# EAGLE design ac (EAGLE 7.4.0)
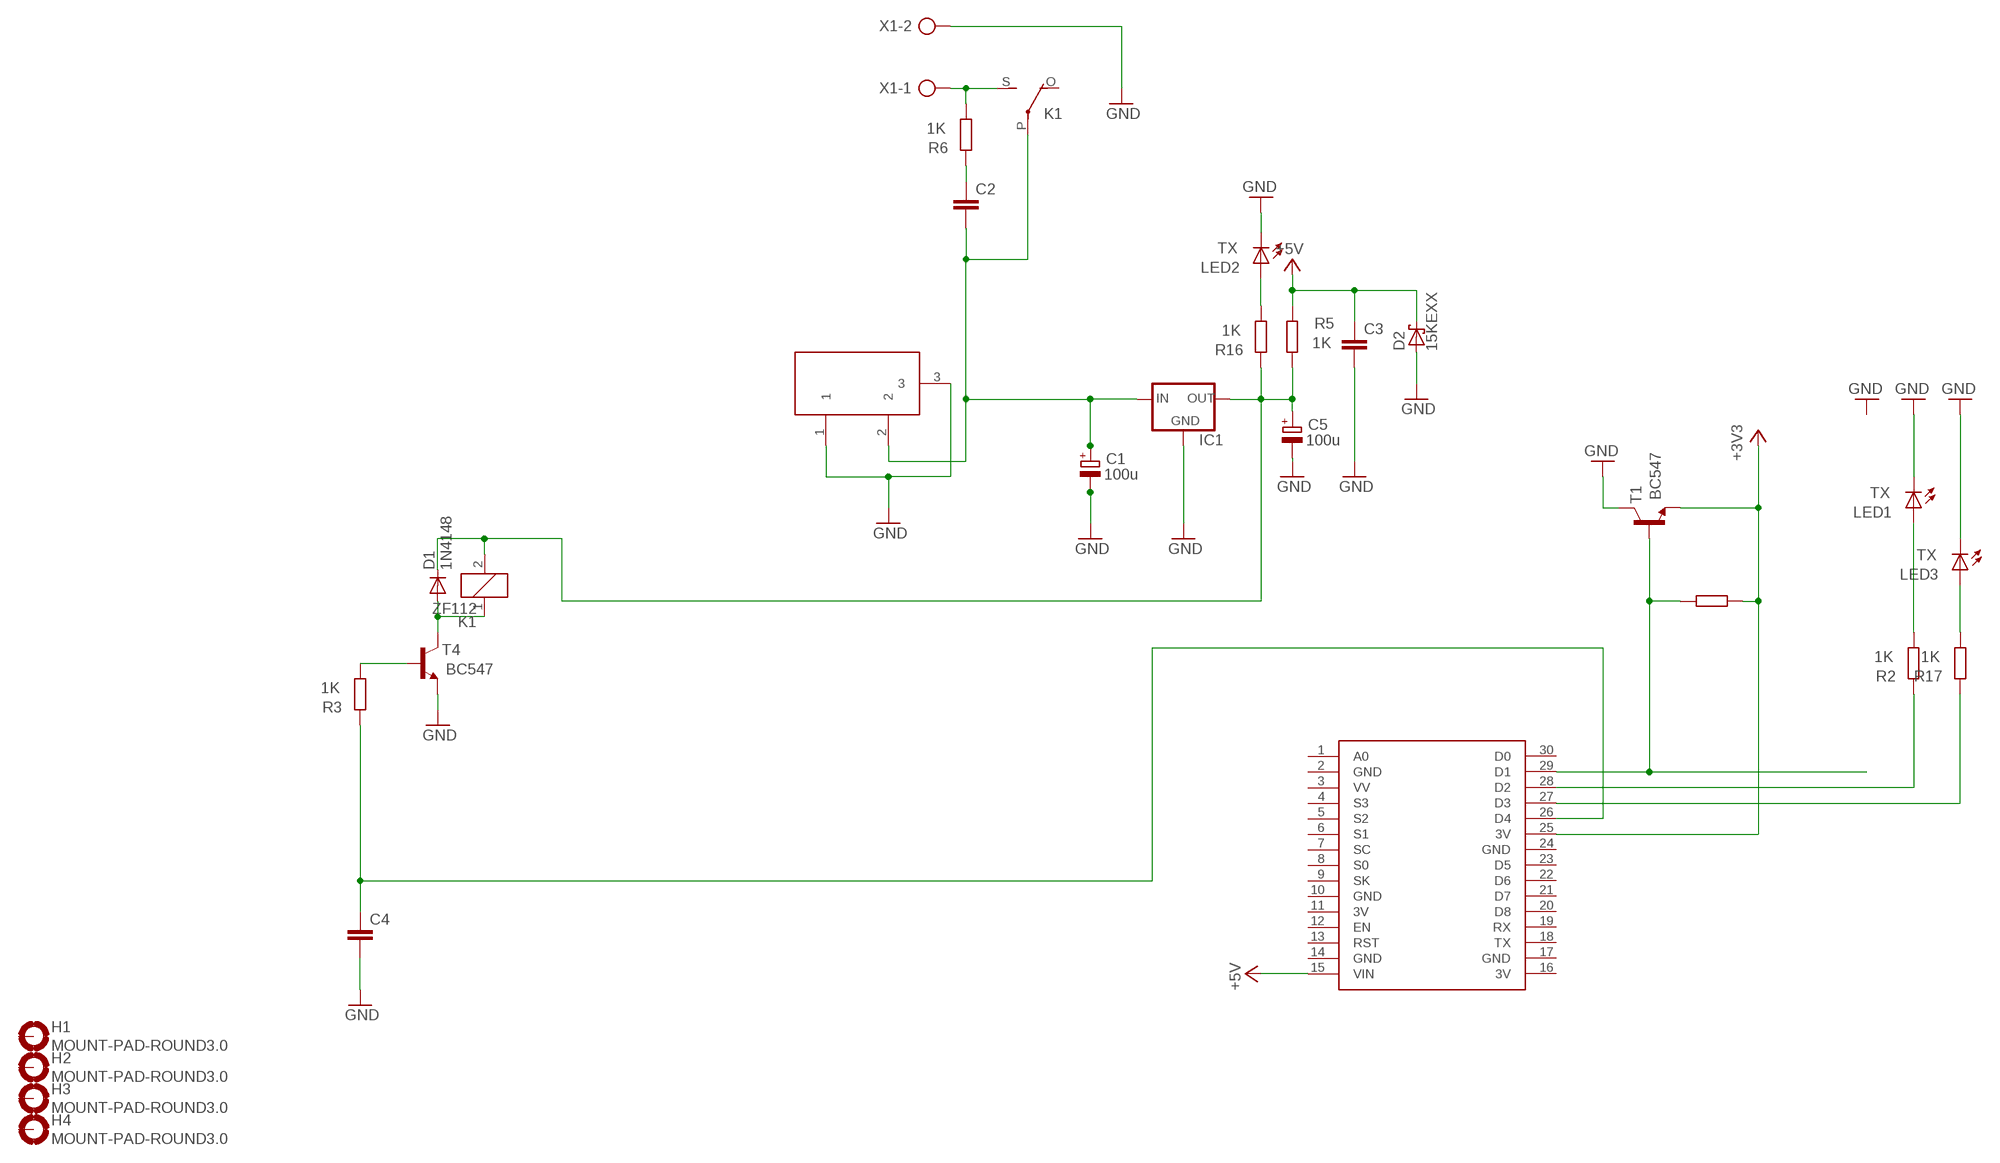
[diagram p0: schematic, sheet 1]

## Parts
C1  100u  CPOL-EUE3.5-8  [E3,5-8]
C2  C-EU102-043X133  [C102-043X133]
C3  C-EU102-043X133  [C102-043X133]
C4  C-EU102-043X133  [C102-043X133]
C5  100u  CPOL-EUE3.5-8  [E3,5-8]
D1  1N4148  [DO35-10]
D2  15KEXX  [CB429-17]
DC1  DC21MMX  [DC-21MM]
H1  MOUNT-PAD-ROUND3.0  [3,0-PAD]
H2  MOUNT-PAD-ROUND3.0  [3,0-PAD]
H3  MOUNT-PAD-ROUND3.0  [3,0-PAD]
H4  MOUNT-PAD-ROUND3.0  [3,0-PAD]
IC1  78XXS  [78XXS]
K1  ZF112  [ZF112]
LED1  TX  LED5MM  [LED5MM]
LED2  TX  LED5MM  [LED5MM]
LED3  TX  LED5MM  [LED5MM]
R2  1K  R-EU_0207/10  [0207/10]
R3  1K  R-EU_0207/10  [0207/10]
R4  1k  R-EU_0207/10  [0207/10]
R5  1K  R-EU_0207/10  [0207/10]
R6  1K  R-EU_0207/10  [0207/10]
R16  1K  R-EU_0207/10  [0207/10]
R17  1K  R-EU_0207/10  [0207/10]
T1  BC547  [TO92]
T4  BC547  [TO92]
U$1  NODEMCU  [NODEMCU]
X1  AK300/2  [AK300/2]

## Nets
+3V3: R4.1 T1.1(E) U$1.25(3V)
+5V [power]: C3.1 D2.C R5.2 U$1.15(VIN)
GND: C1.- C3.2 C4.2 C5.- D2.A DC1.1 DC1.3 IC1.GND LED1.K(C) LED2.K(C) LED3.K(C) T1.3(C) T4.1(E) X1.2
N$1: R3.1 T4.2(B)
N$2: K1.S(2:S) R6.1 X1.1
N$4: D1.A K1.1 T4.3(C)
N$5: C2.1 R6.2
N$6: C1.+ C2.2 DC1.2 IC1.IN K1.P(2:P)
N$7 [power]: C5.+ D1.C IC1.OUT K1.2 R5.1 R16.2
N$11: R4.2 T1.2(B) U$1.29(D1)
N$12: R2.2 U$1.28(D2)
N$13: R17.2 U$1.27(D3)
N$14: C4.1 R3.2 U$1.26(D4)
N$19: LED2.A R16.1
N$21: LED3.A R17.1
N$32: LED1.A R2.1
Unconnected: H1.B3,0(MOUNT) H2.B3,0(MOUNT) H3.B3,0(MOUNT) H4.B3,0(MOUNT) K1.O(2:O) U$1.1(A0) U$1.3(VV) U$1.4(S3) U$1.5(S2) U$1.6(S1) U$1.7(SC) U$1.8(S0) U$1.9(SK) U$1.12(EN) U$1.13(RST) U$1.18(TX) U$1.19(RX) U$1.20(D8) U$1.21(D7) U$1.22(D6) U$1.23(D5) U$1.30(D0)

## Power pins joined to a net without a drawn wire
3V: U$1.11(3V) U$1.16(3V)
GND: U$1.2(GND) U$1.10(GND) U$1.14(GND) U$1.17(GND) U$1.24(GND)

## Library data of the parts
C1 C5 = rcl:CPOL-EU: POLARIZED CAPACITOR, European symbol
C2-C4 = rcl:C-EU: CAPACITOR, European symbol
D1 = diode:1N4148: DIODE high speed (Philips)
D2 = diode:15KEXX: DIODE
DC1 = powersupply:DC21MM
H1-H4 = holes:MOUNT-PAD-ROUND: MOUNTING PAD, round
IC1 = v-reg:78XXS: VOLTAGE REGULATOR
K1 = relay:ZF112: RELAY 1 x switch; OC_FARNELL: unknown; OC_NEWARK: unknown
LED1-LED3 = led:LED: LED OSRAM: - CHIPLED LG R971, LG N971, LY N971, LG Q971, LY Q971, LO R971, LY R971 LH N974, LH R974 LS Q976, LO Q976, LY Q976 LO Q996 - Hyper CHIPLED LW Q18S LB Q993, LB Q99A, LB R99A - SideLED LS A670, LO A670, LY A670, LG A670, LP A670 LB A673, LV A673, LT A673, LW A673 LH A674 LY A675 LS A676, LA A676, LO A676, LY A676, LW A676 LS A679, LY A679, LG A679 - Hyper Micro SIDELED® LS Y876, LA Y876, LO Y876, LY Y876 LT Y87S - SmartLED LW L88C, LW L88S LB L89C, LB L89S, LG L890 LS L89K, LO L89K, LY L89K LS L896, LA L896, LO L896, LY L896 - TOPLED LS T670, LO T670, LY T670, LG T670, LP T670 LSG T670, LSP T670, LSY T670, LOP T670, LYG T670 LG T671, LOG T671, LSG T671 LB T673, LV T673, LT T673, LW T673 LH T674 LS T676, LA T676, LO T676, LY T676, LB T676, LH T676, LSB T676, LW T676 LB T67C, LV T67C, LT T67C, LS T67K, LO T67K, LY T67K, LW E67C LS E67B, LA E67B, LO E67B, LY E67B, LB E67C, LV E67C, LT E67C LW T67C LS T679, LY T679, LG T679 LS T770, LO T770, LY T770, LG T770, LP T770 LB T773, LV T773, LT T773, LW T773 LH T774 LS E675, LA E675, LY E675, LS T675 LS T776, LA T776, LO T776, LY T776, LB T776 LHGB T686 LT T68C, LB T68C - Hyper Mini TOPLED® LB M676 - Mini TOPLED Santana® LG M470 LS M47K, LO M47K, LY M47K Source: http://www.osram.convergy.de LUXEON: - LUMILED® LXK2-PW12-R00, LXK2-PW12-S00, LXK2-PW14-U00, LXK2-PW14-V00 LXK2-PM12-R00, LXK2-PM12-S00, LXK2-PM14-U00 LXK2-PE12-Q00, LXK2-PE12-R00, LXK2-PE12-S00, LXK2-PE14-T00, LXK2-PE14-U00 LXK2-PB12-K00, LXK2-PB12-L00, LXK2-PB12-M00, LXK2-PB14-N00, LXK2-PB14-P00, LXK2-PB14-Q00 LXK2-PR12-L00, LXK2-PR12-M00, LXK2-PR14-Q00, LXK2-PR14-R00 LXK2-PD12-Q00, LXK2-PD12-R00, LXK2-PD12-S00 LXK2-PH12-R00, LXK2-PH12-S00 LXK2-PL12-P00, LXK2-PL12-Q00, LXK2-PL12-R00 Source: www.luxeon.com KINGBRIGHT: KA-3528ASYC Source: www.kingbright.com
R2-R6 R16 R17 = rcl:R-EU_: RESISTOR, European symbol
T1 T4 = transistor:BC547: NPN TRANSISTOR
U$1 = nodemcu:NODEMCU
X1 = con-ptr500:AK300/2: CONNECTOR; OC_FARNELL: unknown; OC_NEWARK: unknown

## Net classes
1 power: width 0.61 mm

## Board
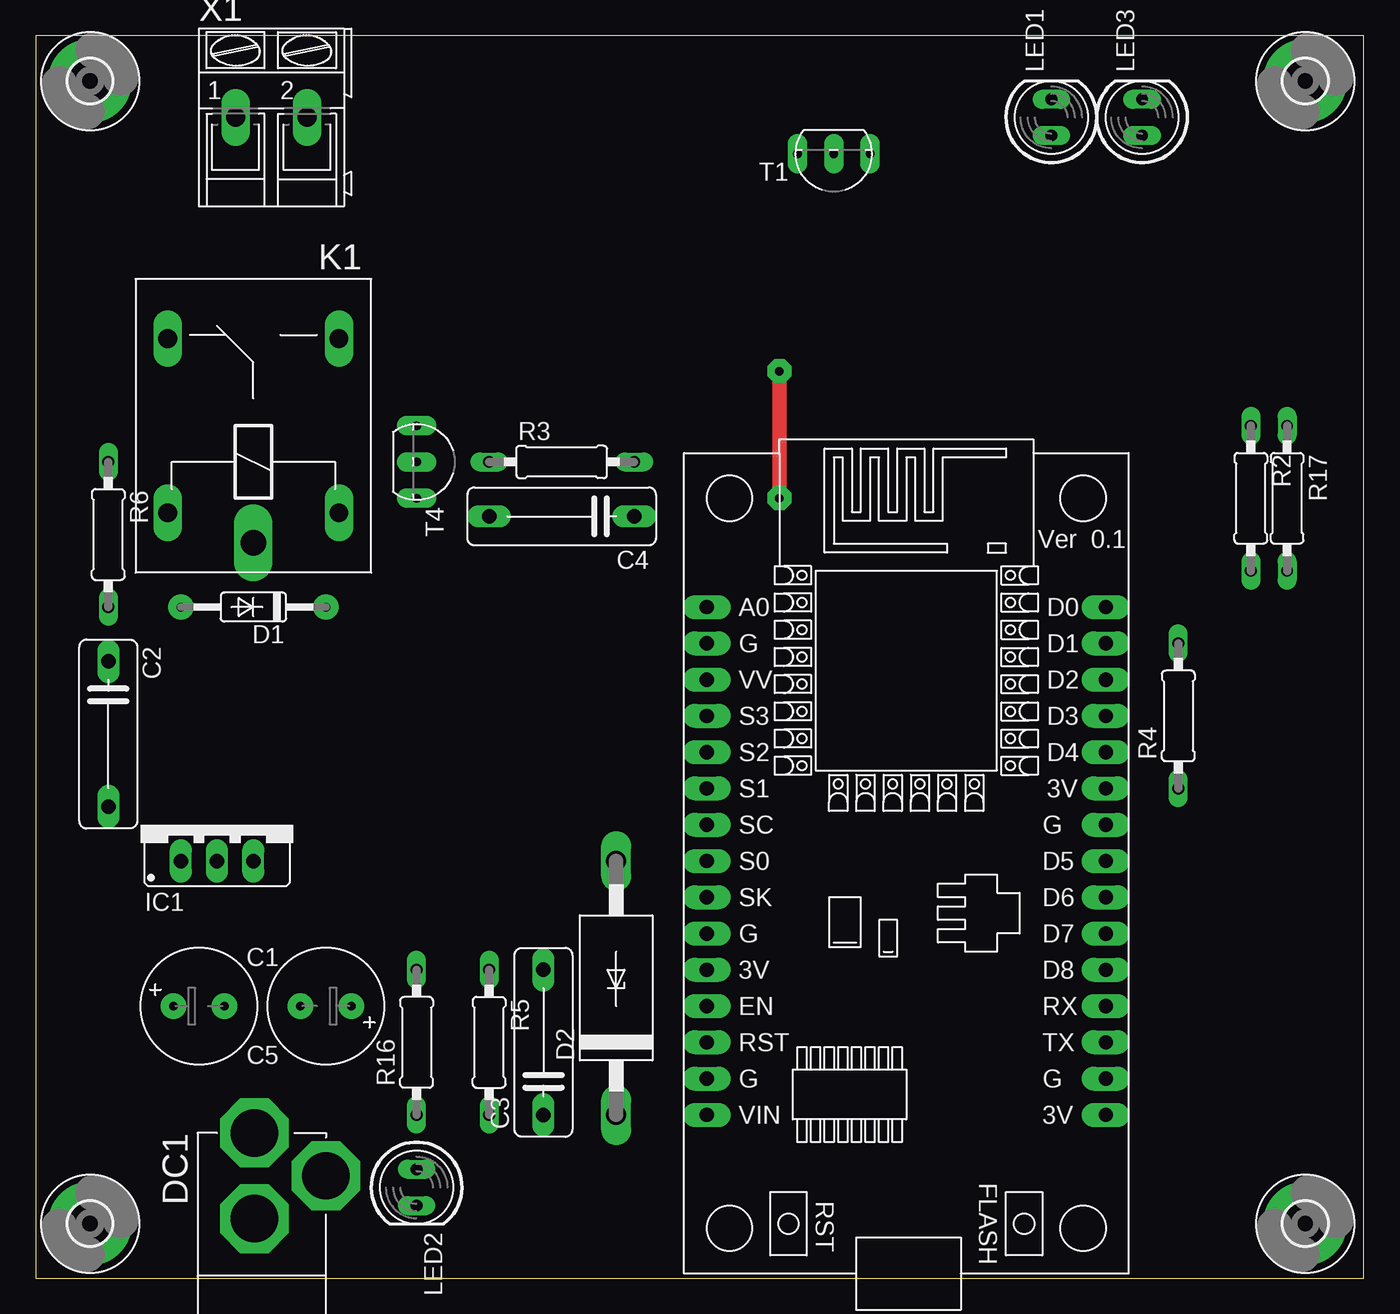
[diagram p1: board, top side]
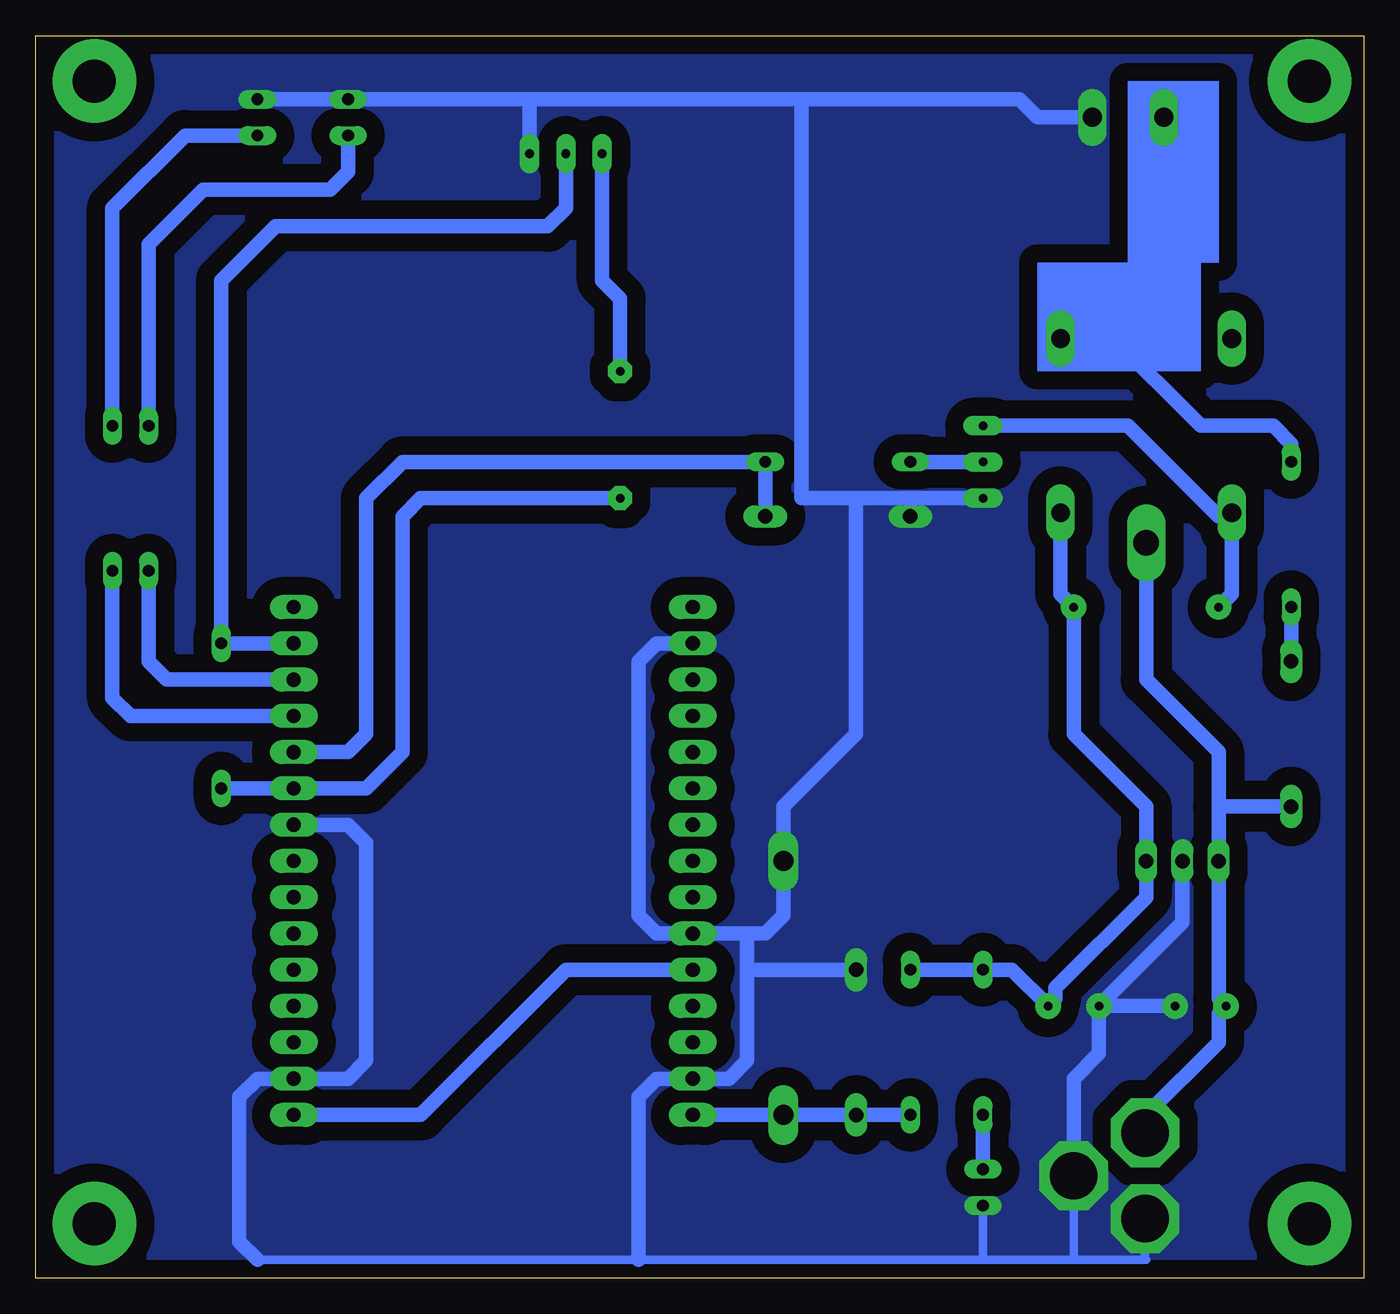
[diagram p2: board, bottom side, seen from below]

Size 93 x 87 mm. Coordinates in mm from the lower left corner, seen from the top.
Outline: 0,0 93,0 93,87 0,87 0,0
Copper layers (1*16): Top 0.035mm / dielectric 1.5mm / Bottom 0.035mm
Design rules "default": minimum track width 10mil, minimum drill 24mil, track to track 8mil, track to pad 8mil, pad to pad 8mil, via to via 8mil, smd to smd 8mil, copper to edge 40mil, drill to drill 8mil, minimum pad ring 10mil, minimum via ring 8mil, stop-mask expansion 4mil, vias tented up to drill 0mil, thermal gap 10mil

### Footprints (pad centres in the part's own frame; a part is rotated, then mirrored left to right if it is on the bottom)
E3,5-8 = drill 0.6 pad 1.778: + -1.778,0; - 1.778,0
C102-043X133 = drill 1.016 long: 1 -5.08,0; 2 5.08,0
DO35-10 = drill 0.6 pad 1.778: A 5.08,0; C -5.08,0
CB429-17 = drill 1.397 long: A 8.89,0; C -8.89,0
DC-21MM = drill 3.302 pad 4.826 octagon: 1 -5.08,-3.353; 2 -0.076,-6.35; 3 -0.076,-0.356
3,0-PAD = drill 3 pad 5.842: B3,0 0,0
78XXS = drill 1.016 long: GND 0,-2.54; IN -2.54,-2.54; OUT 2.54,-2.54
ZF112 = drill 1.321 long: 1 -6.096,5.994; 2 -6.096,-5.994; O 6.096,5.994; S 6.096,-5.994 | drill 1.803 long: P -8.204,0
LED5MM = drill 0.813 long: A -1.27,0; K 1.27,0
0207/10 = drill 0.813 long: 1 -5.08,0; 2 5.08,0
TO92 = drill 0.6 pad 1.372 long: 1 2.54,0; 2 0,0; 3 -2.54,0
NODEMCU = drill 1 pad 1.676 long: 1 -13.97,17.78; 2 -13.97,15.24; 3 -13.97,12.7; 4 -13.97,10.16; 5 -13.97,7.62; 6 -13.97,5.08; 7 -13.97,2.54; 8 -13.97,0; 9 -13.97,-2.54; 10 -13.97,-5.08; 11 -13.97,-7.62; 12 -13.97,-10.16; 13 -13.97,-12.7; 14 -13.97,-15.24; 15 -13.97,-17.78; 16 13.97,-17.78; 17 13.97,-15.24; 18 13.97,-12.7; 19 13.97,-10.16; 20 13.97,-7.62; 21 13.97,-5.08; 22 13.97,-2.54; 23 13.97,0; 24 13.97,2.54; 25 13.97,5.08; 26 13.97,7.62; 27 13.97,10.16; 28 13.97,12.7; 29 13.97,15.24; 30 13.97,17.78
AK300/2 = drill 1.321 long: 1 -2.515,0; 2 2.489,0

### Placement (x,y rotation side)
C1  11.43,19.05 0 top
C2  5.08,38.1 270 top
C3  35.56,16.51 90 top
C4  36.83,53.34 180 top
C5  20.32,19.05 180 top
D1  15.24,46.99 180 top
D2  40.64,20.32 90 top
DC1  15.24,3.81 180 top
H1  88.9,3.81 0 top
H2  88.9,83.82 0 top
H3  3.81,83.82 0 top
H4  3.81,3.81 0 top
IC1  12.7,31.75 0 top
K1  15.24,59.69 90 top
LED1  71.12,81.28 90 top
LED2  26.67,6.35 270 top
LED3  77.47,81.28 90 top
R2  85.09,54.61 270 top
R3  36.83,57.15 0 top
R4  80.01,39.37 90 top
R5  31.75,16.51 270 top
R6  5.08,52.07 270 top
R16  26.67,16.51 90 top
R17  87.63,54.61 270 top
T1  55.88,78.74 180 top
T4  26.67,57.15 270 top
U$1  60.96,29.21 0 top
X1  16.51,81.28 0 top

### Tracks (layer width: path | path; a pad name or v marks a point on that pad's centre or on a via)
3V
  Bottom 1.016: U$1.11 55.88,21.59 66.04,11.43 U$1.16
+3V3  (via drill 0.6 pad 1.68)
  Top 1.016: v52.07,54.61 v52.07,63.5
  Bottom 1.016: R4.1 U$1.25 69.85,34.29 67.31,36.83 67.31,53.34 66.04,54.61 v52.07,54.61 | v52.07,63.5 52.07,68.58 53.34,69.85 T1.1
+5V
  Bottom 1.016: U$1.15 D2.C C3.1 R5.2
GND
  Bottom 0.61: 77.47,1.27 50.8,1.27 26.67,1.27 | 26.67,1.27 20.32,1.27 | 20.32,1.27 15.24,1.27 15.32,1.35 DC1.3 | DC1.1 20.32,1.27 | LED2.K 26.67,1.27
  Bottom 1.016: U$1.2 49.53,44.45 50.8,43.18 50.8,25.4 49.53,24.13 U$1.10 43.18,24.13 | 43.18,24.13 43.18,21.59 | 43.18,21.59 43.18,15.24 44.45,13.97 U$1.14 49.53,13.97 50.8,12.7 50.8,1.27 | LED3.K LED1.K 58.42,82.55 | U$1.24 71.12,31.75 69.85,30.48 69.85,15.24 71.12,13.97 U$1.17 77.47,13.97 78.74,12.7 78.74,2.54 77.47,1.27 | 39.37,82.55 39.37,54.61 35.56,54.61 | T4.1 31.75,54.61 | 31.75,54.61 35.56,54.61 | IC1.GND 12.7,24.89 C5.- | C5.- 18.54,15.75 20.32,13.97 DC1.1 | C1.- C5.- | 43.18,24.13 41.91,24.13 40.64,25.4 D2.A 40.64,33.02 35.56,38.1 35.56,54.61 | T1.3 58.42,82.55 | 39.37,82.55 58.42,82.55 | 39.37,82.55 24.13,82.55 22.86,81.28 X1.2 | C3.2 43.18,21.59 | C4.2 31.75,54.61
  pour Bottom (isolate 1.27, no thermals): -1.27,-1.27 -8.89,90.17 93.98,87.63 93.98,-1.27
N$1
  Bottom 1.016: R3.1 T4.2
N$2
  Bottom 1.016: R6.1 5.08,58.42 6.35,59.69 11.43,59.69 17.78,66.04 | 17.78,66.04 20.98,66.04 K1.S | X1.1 13.99,69.83 17.78,66.04
N$4
  Bottom 1.016: T4.3 16.51,59.69 10.16,53.34 9.5,53.34 K1.1 9.25,47.9 D1.A
N$5
  Bottom 1.016: C2.1 R6.2
N$6
  Bottom 1.016: K1.P 15.24,41.91 10.16,36.83 10.16,33.02 | 10.16,33.02 IC1.IN 10.16,19.56 C1.+ 10.16,18.54 10.16,16.51 15.32,11.35 DC1.2 | C2.2 10.16,33.02
N$7
  Bottom 1.016: K1.2 21.23,47.9 D1.C 20.32,38.1 15.24,33.02 IC1.OUT 15.24,26.67 21.59,20.32 21.59,19.56 C5.+ 24.64,21.59 R16.2 R5.1
N$11
  Bottom 1.016: U$1.29 R4.2 80.01,69.85 76.2,73.66 57.15,73.66 55.88,74.93 T1.2
N$12
  Bottom 1.016: R2.2 85.09,43.18 83.82,41.91 U$1.28
N$13
  Bottom 1.016: U$1.27 86.36,39.37 87.63,40.64 R17.2
N$14
  Bottom 1.016: U$1.26 71.12,36.83 69.85,38.1 69.85,54.61 67.31,57.15 R3.2 C4.1
N$19
  Bottom 1.016: R16.1 LED2.A
N$21
  Bottom 1.016: R17.1 87.63,74.93 82.55,80.01 LED3.A
N$32
  Bottom 1.016: LED1.A 71.12,78.74 71.12,77.47 72.39,76.2 81.28,76.2 85.09,72.39 85.09,66.04 R2.1
(copper drawn outside any net)
  shapes: Bottom area x2